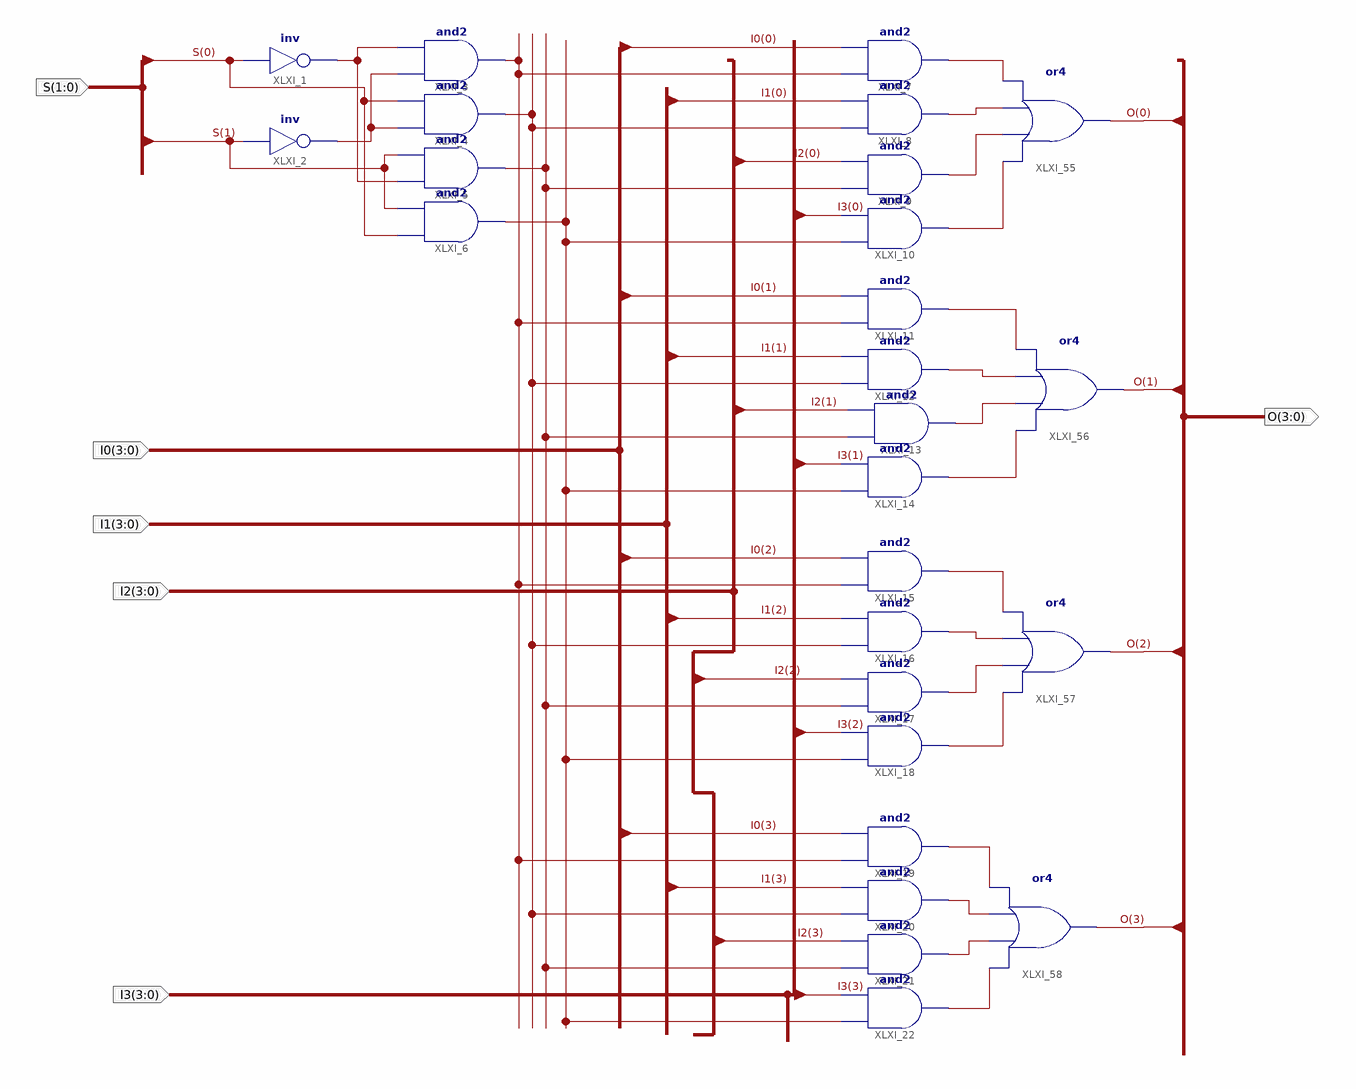
[diagram p0: schematic sheet 1]
// Xilinx ISE schematic MUX4T1.sch (kintex7) as structural Verilog: 26 symbols, 6 ports
module MUX4T1 (
  input  [1:0] S,
  input  [3:0] I0,
  input  [3:0] I1,
  input  [3:0] I2,
  input  [3:0] I3,
  output [3:0] O
);

  wire XLXN_5, XLXN_6, XLXN_8, XLXN_9, XLXN_10, XLXN_11, XLXN_39, XLXN_40, XLXN_41, XLXN_42, XLXN_43,
       XLXN_44, XLXN_45, XLXN_46, XLXN_47, XLXN_48, XLXN_49, XLXN_50, XLXN_51, XLXN_52, XLXN_53, XLXN_54;

  not XLXI_1 (XLXN_5, S[0]);
  not XLXI_2 (XLXN_6, S[1]);
  and XLXI_3 (XLXN_8, XLXN_6, XLXN_5);
  and XLXI_4 (XLXN_9, XLXN_6, S[0]);
  and XLXI_5 (XLXN_10, XLXN_5, S[1]);
  and XLXI_6 (XLXN_11, S[0], S[1]);
  and XLXI_7 (XLXN_39, XLXN_8, I0[0]);
  and XLXI_8 (XLXN_40, XLXN_9, I1[0]);
  and XLXI_9 (XLXN_41, XLXN_10, I2[0]);
  and XLXI_10 (XLXN_42, XLXN_11, I3[0]);
  and XLXI_11 (XLXN_43, XLXN_8, I0[1]);
  and XLXI_12 (XLXN_44, XLXN_9, I1[1]);
  and XLXI_13 (XLXN_45, XLXN_10, I2[1]);
  and XLXI_14 (XLXN_46, XLXN_11, I3[1]);
  and XLXI_15 (XLXN_47, XLXN_8, I0[2]);
  and XLXI_16 (XLXN_48, XLXN_9, I1[2]);
  and XLXI_17 (XLXN_49, XLXN_10, I2[2]);
  and XLXI_18 (XLXN_50, XLXN_11, I3[2]);
  and XLXI_19 (XLXN_51, XLXN_8, I0[3]);
  and XLXI_20 (XLXN_52, XLXN_9, I1[3]);
  and XLXI_21 (XLXN_53, XLXN_10, I2[3]);
  and XLXI_22 (XLXN_54, XLXN_11, I3[3]);
  or XLXI_55 (O[0], XLXN_42, XLXN_41, XLXN_40, XLXN_39);
  or XLXI_56 (O[1], XLXN_46, XLXN_45, XLXN_44, XLXN_43);
  or XLXI_57 (O[2], XLXN_50, XLXN_49, XLXN_48, XLXN_47);
  or XLXI_58 (O[3], XLXN_54, XLXN_53, XLXN_52, XLXN_51);
endmodule
